# Altium schematic sheet PMU.SchDoc
size A3; SheetNumber: 2; SheetTotal: 4
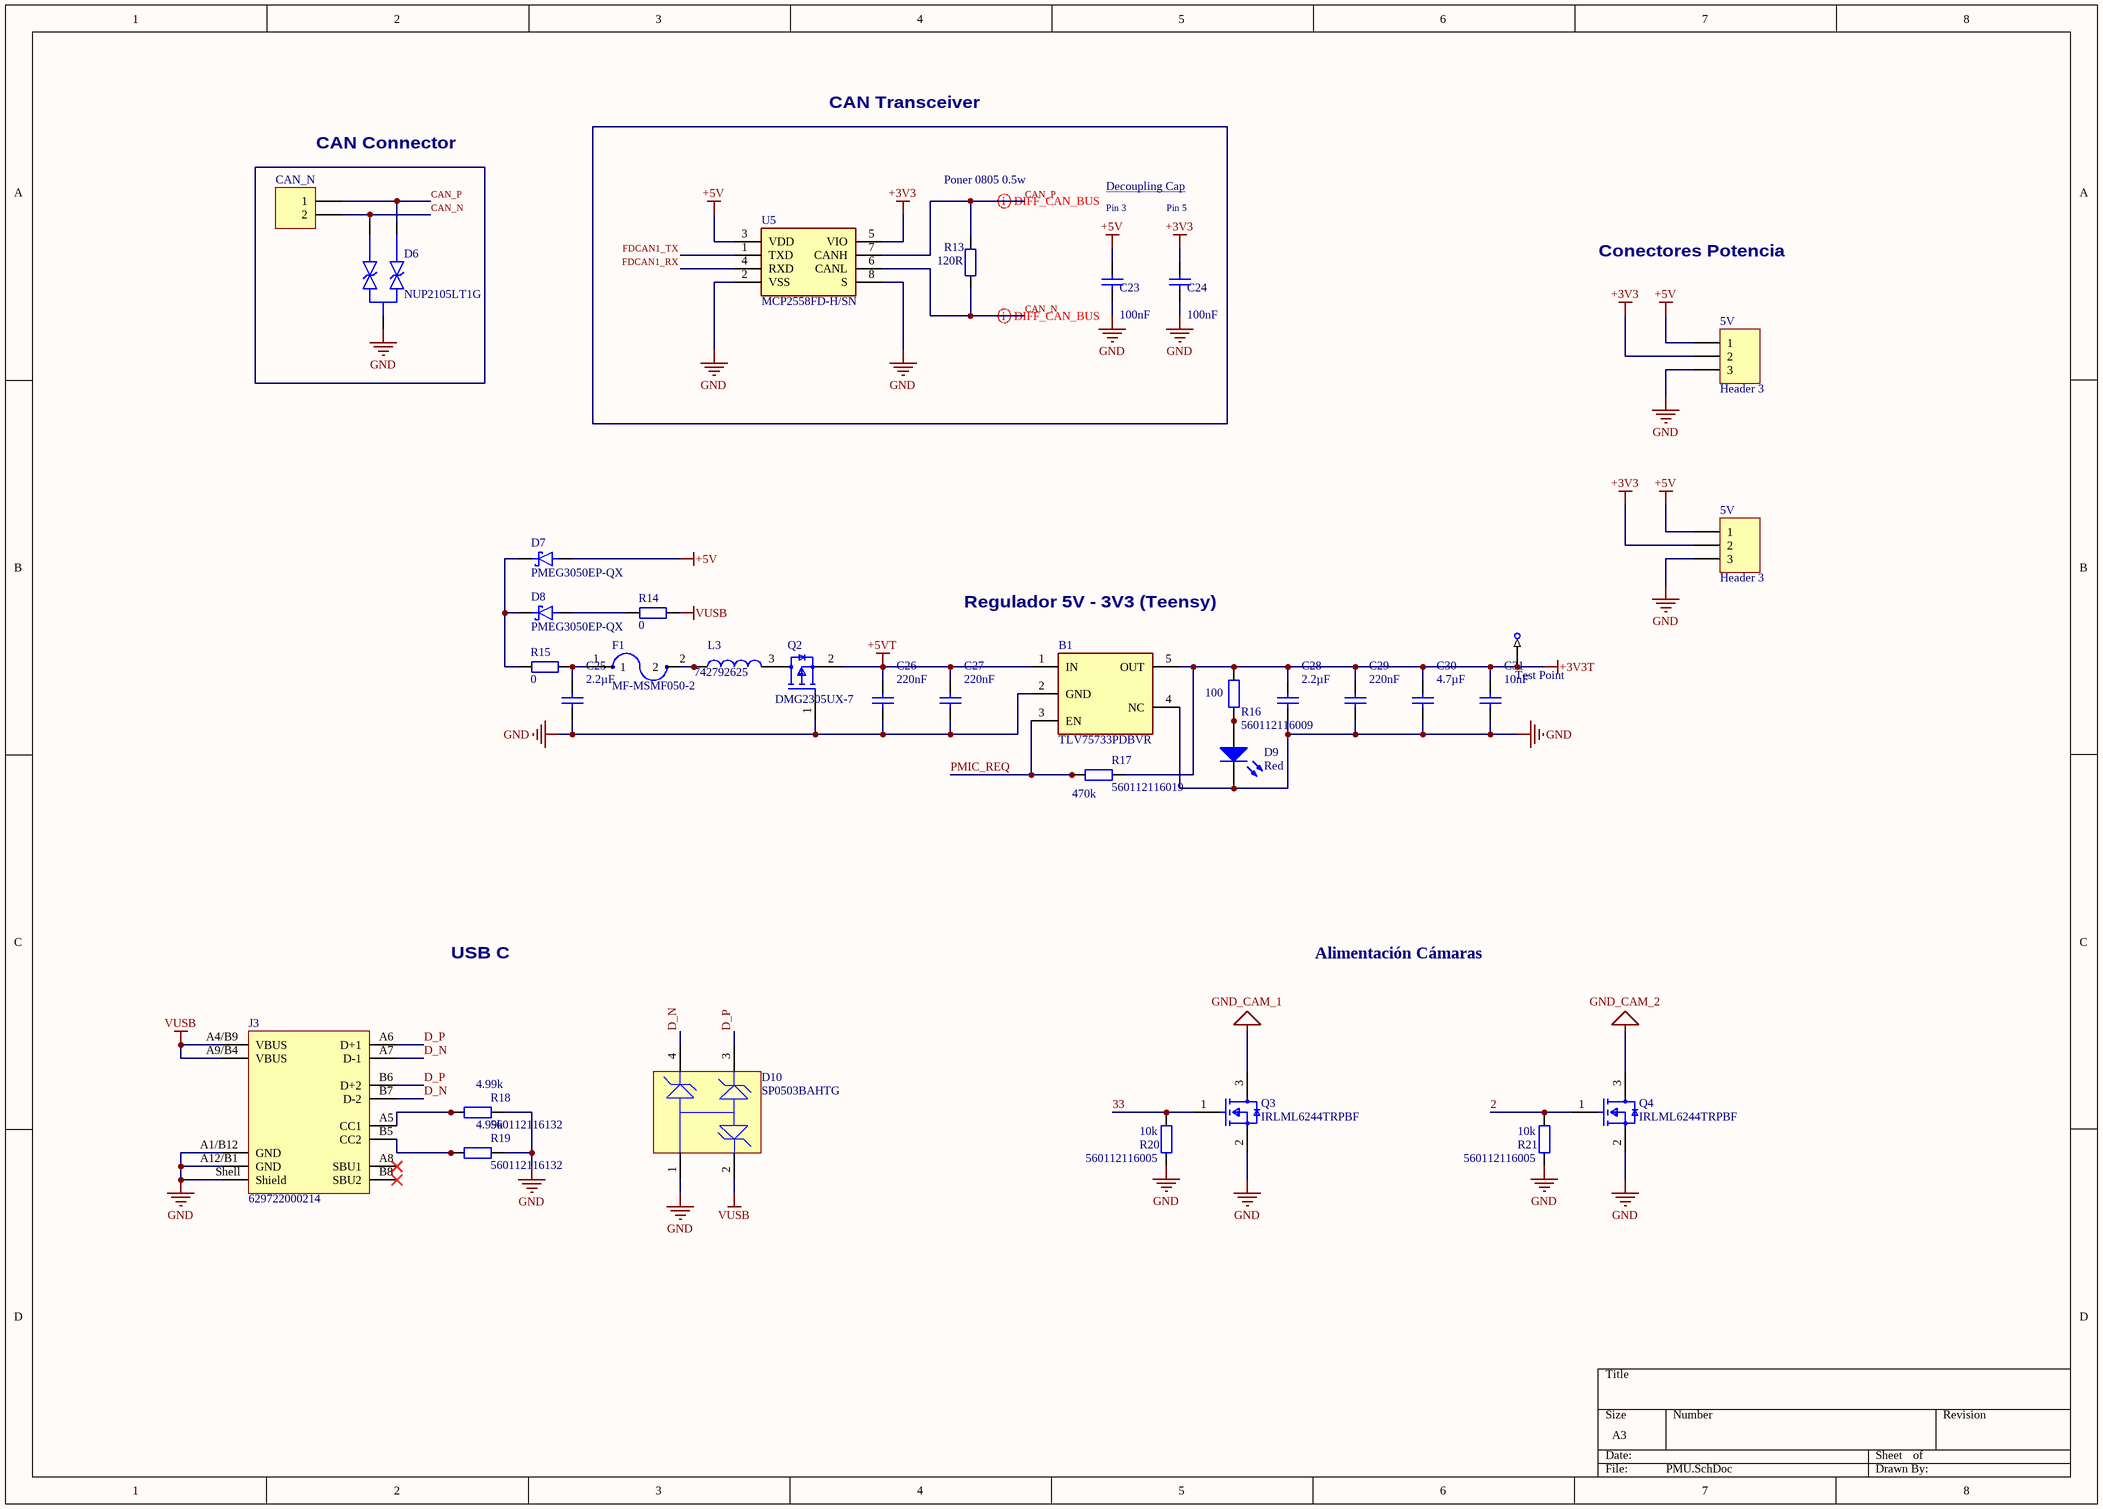
[diagram p0: PMU.SchDoc]

## Parts
(Parts that share a designator on the sheet are numbered #1, #2 ... from top to bottom, then left to right.)
5V#1  Header 3  [JST XH 3]
5V#2  Header 3  [JST XH 3]
B1  TLV75733PDBVR  [SOT95P280X145-5N]
C23  value 100nF  [WCAP-CSGP_0603_L1.6W0.8H0.8_Reflow]  (hidden comment: 885012206071)
C24  value 100nF  [WCAP-CSGP_0603_L1.6W0.8H0.8_Reflow]  (hidden comment: 885012206071)
C25  value 2.2µF  [WCAP-CSGP_0603_L1.6W0.8H0.8_Reflow]  (hidden comment: 885012106018)
C26  value 220nF  [WCAP-CSGP_0603_L1.6W0.8H0.8_Reflow]  (hidden comment: 885012206073)
C27  value 220nF  [WCAP-CSGP_0603_L1.6W0.8H0.8_Reflow]  (hidden comment: 885012206073)
C28  value 2.2µF  [WCAP-CSGP_0603_L1.6W0.8H0.8_Reflow]  (hidden comment: 885012106018)
C29  value 220nF  [WCAP-CSGP_0603_L1.6W0.8H0.8_Reflow]  (hidden comment: 885012206073)
C30  value 4.7µF  [WCAP-CSGP_0603_L1.6W0.8H0.8_Reflow]  (hidden comment: 885012106012)
C31  value 10nF  [WCAP-CSGP_0603_L1.6W0.8H0.8_Reflow]  (hidden comment: 885012206065)
CAN_N  JST Header Male 2 pin  [XH 2]  (value not drawn)
D6  NUP2105LT1G  [NUP2105LT1G-Footprint-1]
D7  PMEG3050EP-QX  [PMEG3050EP-QX-Footprint-1]
D8  PMEG3050EP-QX  [PMEG3050EP-QX-Footprint-1]
D9  Red  [MY_LED_0805]
D10  SP0503BAHTG  [LFUS-SOT143-4_V]
F1  MF-MSMF050-2  [FUSM4632X85]
J3  629722000214  [629722000214]
L3  742792625  [WE-CBF_0603_L1.6W0.8H0.8_HC]
Q2  DMG2305UX-7  [FP-SOT23-IPC_C]
Q3  IRLML6244TRPBF  [FP-Micro3-IPC_C]
Q4  IRLML6244TRPBF  [FP-Micro3-IPC_C]
R13  120R  [R0603-0.45]
R14  0  [R0603-0.45]
R15  0  [R0603-0.45]
R16  560112116009  value 100  [WRIS-RSKS_0603_Reflow]
R17  560112116019  value 470k  [WRIS-RSKS_0603_Reflow]
R18  560112116132  value 4.99k  [WRIS-RSKS_0603_Reflow]
R19  560112116132  value 4.99k  [WRIS-RSKS_0603_Reflow]
R20  560112116005  value 10k  [WRIS-RSKS_0603_Reflow]
R21  560112116005  value 10k  [WRIS-RSKS_0603_Reflow]
TP1  Test Point  [MY_Testpad1]  (no BOM)
U5  MCP2558FD-H/SN  [MCP2557FD-H_SN-Footprint-1]

## Blocks framed on the sheet
CAN Transceiver: C23 C24 R13 U5
CAN Connector: CAN_N D6

## Nets
+3V3: 5V#1.2 5V#2.2 C24.2 U5.5(VIO)
+3V3T: B1.5(OUT) C28.1 C29.1 C30.1 C31.1 R16.2 R17.1 TP1.1
+5V: 5V#1.1 5V#2.1 C23.2 D7.1 U5.3(VDD)
+5VT: B1.1(IN) C26.1 C27.1 Q2.2(SOURCE)
GND: 5V#1.3 5V#2.3 B1.2(GND) B1.4(NC) C23.1 C24.1 C25.2 C26.2 C27.2 C28.2 C29.2 C30.2 C31.2 D6.3 D9.K D10.1 J3.A1/B12(GND) J3.A12/B1(GND) J3.Shell(Shield) Q2.1(GATE) Q3.2(S) Q4.2(S) R18.1 R19.1 U5.2(VSS) U5.8(S)
GND_CAM_1: Q3.3(D)
GND_CAM_2: Q4.3(D)
VUSB: D10.2 J3.A4/B9(VBUS) J3.A9/B4(VBUS) R14.1
2: Q4.1(G) R21.1
33: Q3.1(G) R20.1
CAN_N: CAN_N.2 D6.2 R13.1 U5.6(CANL)
CAN_P: CAN_N.1 D6.1 R13.2 U5.7(CANH)
D_N: D10.4 J3.A7(D-1) J3.B7(D-2)
D_P: D10.3 J3.A6(D+1) J3.B6(D+2)
FDCAN1_RX: U5.4(RXD)
FDCAN1_TX: U5.1(TXD)
PMIC_REQ: B1.3(EN) R17.2
NetC25_1: C25.1 F1.1 R15.1
NetD7_2: D7.2 D8.2 R15.2
NetD8_1: D8.1 R14.2
NetD9_A: D9.A R16.1
NetF1_2: F1.2 L3.1
NetJ3_A5: J3.A5(CC1) R18.2
NetJ3_B5: J3.B5(CC2) R19.2

Not connected (* = marked no-connect by the designer): J3 A8(SBU1)* B8(SBU2)*; L3 2; Q2 3(DRAIN); R20 2; R21 2

## Layout directives
differential pair; differential pair class CAN_BUS: CAN_N, CAN_P

## Notes on the sheet
- Poner 0805 0.5w
- Decoupling Cap
- Pin 3
- Pin 5
- Conectores Potencia
- Regulador 5V - 3V3 (Teensy)
- USB C
- Alimentación Cámaras
- Labels drawn without touching a wire or pin: GND

## Library data of the parts
5V#1 5V#2 = CMP-016-000017-4: Header, 3-Pin; ASiD Part Number: Header 3-AS; Signal Integrity: Connector; Component Type: Standard; Source: PCB_Project1.SCHLIB; Design Item ID: Header 3; Pin Count: 3
B1 = CMP-087-000000-3: LDO Voltage Regulators 1A Low-IQ Small-Size Low-Dropout (LDO) Regulator 5-SOT-23 -40 to 125; Manufacturer_Name: Texas Instruments; Geometry.Height: 1.45mm; Design Item ID: TLV75733PDBVR; Mouser Part Number: 595-TLV75733PDBVR; Arrow Part Number: TLV75733PDBVR; Mouser Price/Stock: https://www.mouser.co.uk/ProductDetail/Texas-Instruments/TLV75733PDBVR?qs=y6ZabgHbY%252BwAAzSntTW34w%3D%3D; Datasheet Link: http://www.ti.com/lit/gpn/tlv757p; Arrow Price/Stock: https://www.arrow.com/en/products/tlv75733pdbvr/texas-instruments?region=nac; Source: TLV75733PDBVR.SchLib; Manufacturer_Part_Number: TLV75733PDBVR
C23 C24 = CMP-001-00661-1: WCAP-CSGP Multilayer Ceramic Chip Capacitor, General Purpose, size 0603, X7R, 100nF, 25VDC; Manufacturer: Wurth Elektronik; Dissipation Factor: 3.5%; Capacitance Tolerance: +/-10%; Insulation Resistance: 5GOhm; Technical Reference: X7R0603104K025DFCT10000; Rated Voltage (DC): 25V; Manufacturer Part Number: 885012206071; Packaging: Tape and Reel; Height: 0.8mm; Mount: Surface Mount; Source: WCAP-CSGP.SchLib; Component Type: Standard; Category: Multilayer Ceramic Chip Capacitors; Operating Temperature Min: -55°C; Case/Package: 0603; ComponentLink2Description: Datasheet Link; Width: 0.8mm; ComponentLink1URL: https://www.we-online.com/redexpert/article/885012206071?ad; Length: 1.6mm; Operating Temperature Max: 125°C; Match Code: WCAP-CSGP; ComponentLink2URL: https://www.we-online.com/redexpert/spec/885012206071?ad; Design Item ID: 885012206071; ComponentLink1Description: Website Link; Pins: 2; Ceramic Type: X7R
C25 C28 = CMP-001-00446-1: WCAP-CSGP Multilayer Ceramic Chip Capacitor, General Purpose, size 0603, X5R, 2.2uF, 16VDC; Manufacturer: Wurth Elektronik; Rated Voltage (DC): 16V; Insulation Resistance: 0.05GOhm; Dissipation Factor: 10%; Technical Reference: X5R0603225M016DFCT10000; Capacitance Tolerance: +/-20%; Source: WCAP-CSGP.SchLib; Design Item ID: 885012106018; Component Type: Standard; Height: 0.8mm; Length: 1.6mm; Packaging: Tape and Reel; Match Code: WCAP-CSGP; Ceramic Type: X5R; Category: Multilayer Ceramic Chip Capacitors; Width: 0.8mm; Case/Package: 0603; Mount: Surface Mount; Pins: 2; ComponentLink1URL: https://www.we-online.com/redexpert/article/885012106018?ad; Operating Temperature Min: -55°C; ComponentLink1Description: Website Link; Operating Temperature Max: 85°C; Manufacturer Part Number: 885012106018; ComponentLink2URL: https://www.we-online.com/redexpert/spec/885012106018?ad; ComponentLink2Description: Datasheet Link
C26 C27 C29 = CMP-001-00664-1: WCAP-CSGP Multilayer Ceramic Chip Capacitor, General Purpose, size 0603, X7R, 220nF, 25VDC; Manufacturer: Wurth Elektronik; Rated Voltage (DC): 25V; Insulation Resistance: 2.3GOhm; Capacitance Tolerance: +/-10%; Technical Reference: X7R0603224K025DFCT10000; Dissipation Factor: 3.5%; Source: WCAP-CSGP.SchLib; Design Item ID: 885012206073; Component Type: Standard; Pins: 2; Manufacturer Part Number: 885012206073; Case/Package: 0603; Mount: Surface Mount; Height: 0.8mm; ComponentLink2URL: https://www.we-online.com/redexpert/spec/885012206073?ad; ComponentLink1Description: Website Link; ComponentLink1URL: https://www.we-online.com/redexpert/article/885012206073?ad; ComponentLink2Description: Datasheet Link; Ceramic Type: X7R; Operating Temperature Min: -55°C; Category: Multilayer Ceramic Chip Capacitors; Packaging: Tape and Reel; Length: 1.6mm; Match Code: WCAP-CSGP; Operating Temperature Max: 125°C; Width: 0.8mm
C30 = CMP-001-00440-1: WCAP-CSGP Multilayer Ceramic Chip Capacitor, General Purpose, size 0603, X5R, 4.7uF, 10VDC; Manufacturer: Wurth Elektronik; Rated Voltage (DC): 10V; Technical Reference: X5R0603475M010DFCT10000; Dissipation Factor: 10%; Insulation Resistance: 0.02GOhm; Capacitance Tolerance: +/-20%; Source: WCAP-CSGP.SchLib; Design Item ID: 885012106012; Component Type: Standard; ComponentLink2URL: https://www.we-online.com/redexpert/spec/885012106012?ad; Height: 0.8mm; Packaging: Tape and Reel; Case/Package: 0603; Manufacturer Part Number: 885012106012; Width: 0.8mm; Match Code: WCAP-CSGP; Mount: Surface Mount; Ceramic Type: X5R; Operating Temperature Max: 85°C; ComponentLink1Description: Website Link; Length: 1.6mm; ComponentLink1URL: https://www.we-online.com/redexpert/article/885012106012?ad; ComponentLink2Description: Datasheet Link; Category: Multilayer Ceramic Chip Capacitors; Operating Temperature Min: -55°C; Pins: 2
C31 = CMP-001-00655-1: WCAP-CSGP Multilayer Ceramic Chip Capacitor, General Purpose, size 0603, X7R, 10nF, 25VDC; Manufacturer: Wurth Elektronik; Dissipation Factor: 3.5%; Technical Reference: X7R0603103K025DFCT10000; Capacitance Tolerance: +/-10%; Insulation Resistance: 10GOhm; Rated Voltage (DC): 25V; Source: WCAP-CSGP.SchLib; Design Item ID: 885012206065; Component Type: Standard; ComponentLink1Description: Website Link; Packaging: Tape and Reel; Match Code: WCAP-CSGP; Ceramic Type: X7R; ComponentLink1URL: https://www.we-online.com/redexpert/article/885012206065?ad; ComponentLink2URL: https://www.we-online.com/redexpert/spec/885012206065?ad; Case/Package: 0603; Operating Temperature Min: -55°C; ComponentLink2Description: Datasheet Link; Category: Multilayer Ceramic Chip Capacitors; Pins: 2; Mount: Surface Mount; Height: 0.8mm; Length: 1.6mm; Operating Temperature Max: 125°C; Width: 0.8mm; Manufacturer Part Number: 885012206065
CAN_N = CMP-016-000011-2: Header, 2-Pin; Manufacturer Part Number: XH-2P-M; Manufacturer: JST
D6 = CMP-004-00006-2: Supresor de ESD / diodos TVS 27V CAN BUS Protection; Manufacturer: Onsemi; Manufacturer Part Number: NUP2105LT1G; Case/Package: None; Pins: 3
D7 D8 = CMP-004-00003-1: PMEG3050EP-Q - 30 V, 5 A low VF MEGA Schottky barrier rectifier
D9 = LED: Typical INFRARED GaAs LED; ASiD Part Number: LED-AS
D10 = CMP-004-00005-1: Trans Voltage Suppressor Diode, 5.5V V(RWM), Unidirectional, 3 Element, Silicon, TO-253AA; RoHS Compliant: Yes; Pins: 4
F1 = CMP-043-000000-2: Polymeric PTC Resettable Fuse 15V 500mA Ih Surface Mount 1812 (4532 Metric), Concave; MF: Bourns; Source: LEEM.SchLib; MP: MF-MSMF050-2; Availability: Good; SnapEDA_Link: https://www.snapeda.com/parts/MF-MSMF050-2/Bourns%20-%20J.W.%20Miller/view-part/42625/?ref=snap; Value: *; Design Item ID: MF-MSMF050-2; Price: None; Package: 1812 Bourns; Check_prices: https://www.snapeda.com/parts/MF-MSMF050-2/Bourns%20-%20J.W.%20Miller/view-part/42625/?ref=eda; Purchase-URL: https://pricing.snapeda.com/search/part/MF-MSMF050-2/?ref=eda
J3 = CMP-133-000027-1: WR-COM USB 2.0 Type C Receptacle Horizontal SMT; Manufacturer: Wurth Elektronik; Interface Type: Type C; Rated Current: 5A; Working Voltage: 20V (DC); Match Code: WR-USB; Number of Ports: 1; Orientation: Horizontal; Application: USB 2.0; ComponentLink1Description: Website Link; Gender: Receptacle; Operating Temperature Min: -40°C; Category: Input/Output Connectors; Pin Count: 13; Packaging: Tape and Reel; Operating Temperature Max: 85°C; ComponentLink1URL: https://www.we-online.com/redexpert/article/629722000214?ad; Component Type: Standard; ComponentLink2URL: https://www.we-online.com/redexpert/spec/629722000214?ad; Design Item ID: 629722000214; Number of Pins: 16; Source: WR-USB.SchLib; Manufacturer Part Number: 629722000214; Mount: Surface Mount; ComponentLink2Description: Datasheet Link
L3 = CMP-006-00120-1: WE-CBF SMT EMI Suppression Ferrite Bead, size 0603, 120Ohm, 2A; Manufacturer: Wurth Elektronik; Impedance Max: 180Ohm; Type: High Current; Impedance Max Test Condition: 400MHz; DC Resistance Max: 0.05Ohm; Design Item ID: 742792625; Source: WE-CBF.SchLib; Component Type: Standard; Length: 1.6mm; Mount: Surface Mount; ComponentLink2Description: Datasheet Link; Match Code: WE-CBF; Height: 0.8mm; Pins: 2; Manufacturer Part Number: 742792625; ComponentLink1Description: Website Link; Packaging: Tape and Reel; Operating Temperature Max: 125°C; Operating Temperature Min: -55°C; Rated Current: 2A; ComponentLink1URL: https://www.we-online.com/redexpert/article/742792625?ad; Category: Ferrites for PCB Assembly; ComponentLink2URL: https://www.we-online.com/redexpert/spec/742792625?ad; Case/Package: 0603; Width: 0.8mm; Impedance @100MHz: 120Ohm
Q2 = CMP-013-00002-1: P-Channel 20 V 52 mOhm Surface Mount Enhancement Mode Mosfet - SOT-23-3; Mounting Technology: Surface Mount; RoHS Compliant: Yes; Pins: 3; Case/Package: SOT-23; Max Operating Temperature: 150°C; Min Operating Temperature: -55°C
Q3 Q4 = CMP-013-00010-1: Power Field-Effect Transistor, 6.3A I(D), 20V, 0.021ohm, 1-Element, N-Channel, Silicon, Metal-oxide Semiconductor FET, TO-236AB; RoHS Compliant: Yes; Max Operating Temperature: 150°C; Pins: 3
R13 = CMP-009-000000-3: Resistor, generic; Manufacturer: Panasonic; Manufacturer Part Number: ERJ-P06F1200V; Power Disipation: 0.25W
R14 R15 = CMP-009-000000-6: Resistor, generic; Pin Count: 2; Design Item ID: R; Source: Resistors.SchLib; Component Type: Standard
R16 = CMP-009-00332-1: WRIS-RSKS Thick Film Resistor, size 0603, 100Ohm, 100mW; Manufacturer: Wurth Elektronik; Limiting Element Voltage: 75V; Resistance Tolerance: +/-1%; Temperature Coefficient of Resistance Max: 100ppm/°C; Temperature Coefficient of Resistance Min: -100ppm/°C; Pins: 2; Design Item ID: 560112116009; Source: WRIS-RSKS.SchLib; Case/Package: 0603; Component Type: Standard; Mount: Surface Mount; Height: 0.45mm; Category: Thick Film Resistors; Operating Temperature Min: -55°C; Width: 0.8mm; Manufacturer Part Number: 560112116009; ComponentLink2Description: Datasheet Link; ComponentLink2URL: https://www.we-online.com/redexpert/spec/560112116009?ad; ComponentLink1URL: https://www.we-online.com/redexpert/article/560112116009?ad; Rated Power: 100mW; ComponentLink1Description: Website Link; Operating Temperature Max: 155°C; Packaging: Tape and Reel; Length: 1.6mm; Match Code: WRIS-RSKS
R17 = CMP-009-00342-1: WRIS-RSKS Thick Film Resistor, size 0603, 470000Ohm, 100mW; Manufacturer: Wurth Elektronik; Temperature Coefficient of Resistance Min: -100ppm/°C; Resistance Tolerance: +/-1%; Limiting Element Voltage: 75V; Temperature Coefficient of Resistance Max: 100ppm/°C; Pins: 2; Design Item ID: 560112116019; Source: WRIS-RSKS.SchLib; Case/Package: 0603; Component Type: Standard; ComponentLink2URL: https://www.we-online.com/redexpert/spec/560112116019?ad; ComponentLink1Description: Website Link; Height: 0.45mm; ComponentLink1URL: https://www.we-online.com/redexpert/article/560112116019?ad; Category: Thick Film Resistors; Mount: Surface Mount; Operating Temperature Min: -55°C; Rated Power: 100mW; Packaging: Tape and Reel; Match Code: WRIS-RSKS; Width: 0.8mm; ComponentLink2Description: Datasheet Link; Operating Temperature Max: 155°C; Manufacturer Part Number: 560112116019; Length: 1.6mm
R18 R19 = CMP-009-00455-1: WRIS-RSKS Thick Film Resistor, size 0603, 4990Ohm, 100mW; Manufacturer: Wurth Elektronik; Limiting Element Voltage: 75V; Resistance Tolerance: +/-1%; Temperature Coefficient of Resistance Max: 100ppm/°C; Temperature Coefficient of Resistance Min: -100ppm/°C; Pins: 2; Design Item ID: 560112116132; Source: WRIS-RSKS.SchLib; Case/Package: 0603; Component Type: Standard; Manufacturer Part Number: 560112116132; ComponentLink1URL: https://www.we-online.com/redexpert/article/560112116132?ad; Height: 0.45mm; Match Code: WRIS-RSKS; Packaging: Tape and Reel; Category: Thick Film Resistors; Operating Temperature Max: 155°C; Mount: Surface Mount; Rated Power: 100mW; Width: 0.8mm; Length: 1.6mm; ComponentLink2Description: Datasheet Link; Operating Temperature Min: -55°C; ComponentLink1Description: Website Link; ComponentLink2URL: https://www.we-online.com/redexpert/spec/560112116132?ad
R20 R21 = CMP-009-00328-1: WRIS-RSKS Thick Film Resistor, size 0603, 10000Ohm, 100mW; Manufacturer: Wurth Elektronik; Limiting Element Voltage: 75V; Temperature Coefficient of Resistance Max: 100ppm/°C; Resistance Tolerance: +/-1%; Temperature Coefficient of Resistance Min: -100ppm/°C; Manufacturer Part Number: 560112116005; ComponentLink1Description: Website Link; Case/Package: 0603; Pins: 2; Match Code: WRIS-RSKS; Operating Temperature Max: 155°C; Width: 0.8mm; Design Item ID: 560112116005; Length: 1.6mm; ComponentLink2Description: Datasheet Link; ComponentLink2URL: https://www.we-online.com/redexpert/spec/560112116005?ad; Packaging: Tape and Reel; Source: WRIS-RSKS.SchLib; Height: 0.45mm; Component Type: Standard; Mount: Surface Mount; Operating Temperature Min: -55°C; Rated Power: 100mW; ComponentLink1URL: https://www.we-online.com/redexpert/article/560112116005?ad; Category: Thick Film Resistors
TP1 = CMP-028-000000-1: ASiD Part Number: Test Point-AS; Component Type: Standard (No BOM); Pin Count: 1; Design Item ID: Test Point; Source: PCB_Project1.SCHLIB
U5 = CMP-00024-00000-3: Interfaz CI CAN CAN FD Transceiver with Silent Mode; Manufacturer: Microchip Technology; Manufacturer Part Number: MCP2558FD-H/SN